# EAGLE design SBX_connector_outline (EAGLE 7.3.0)
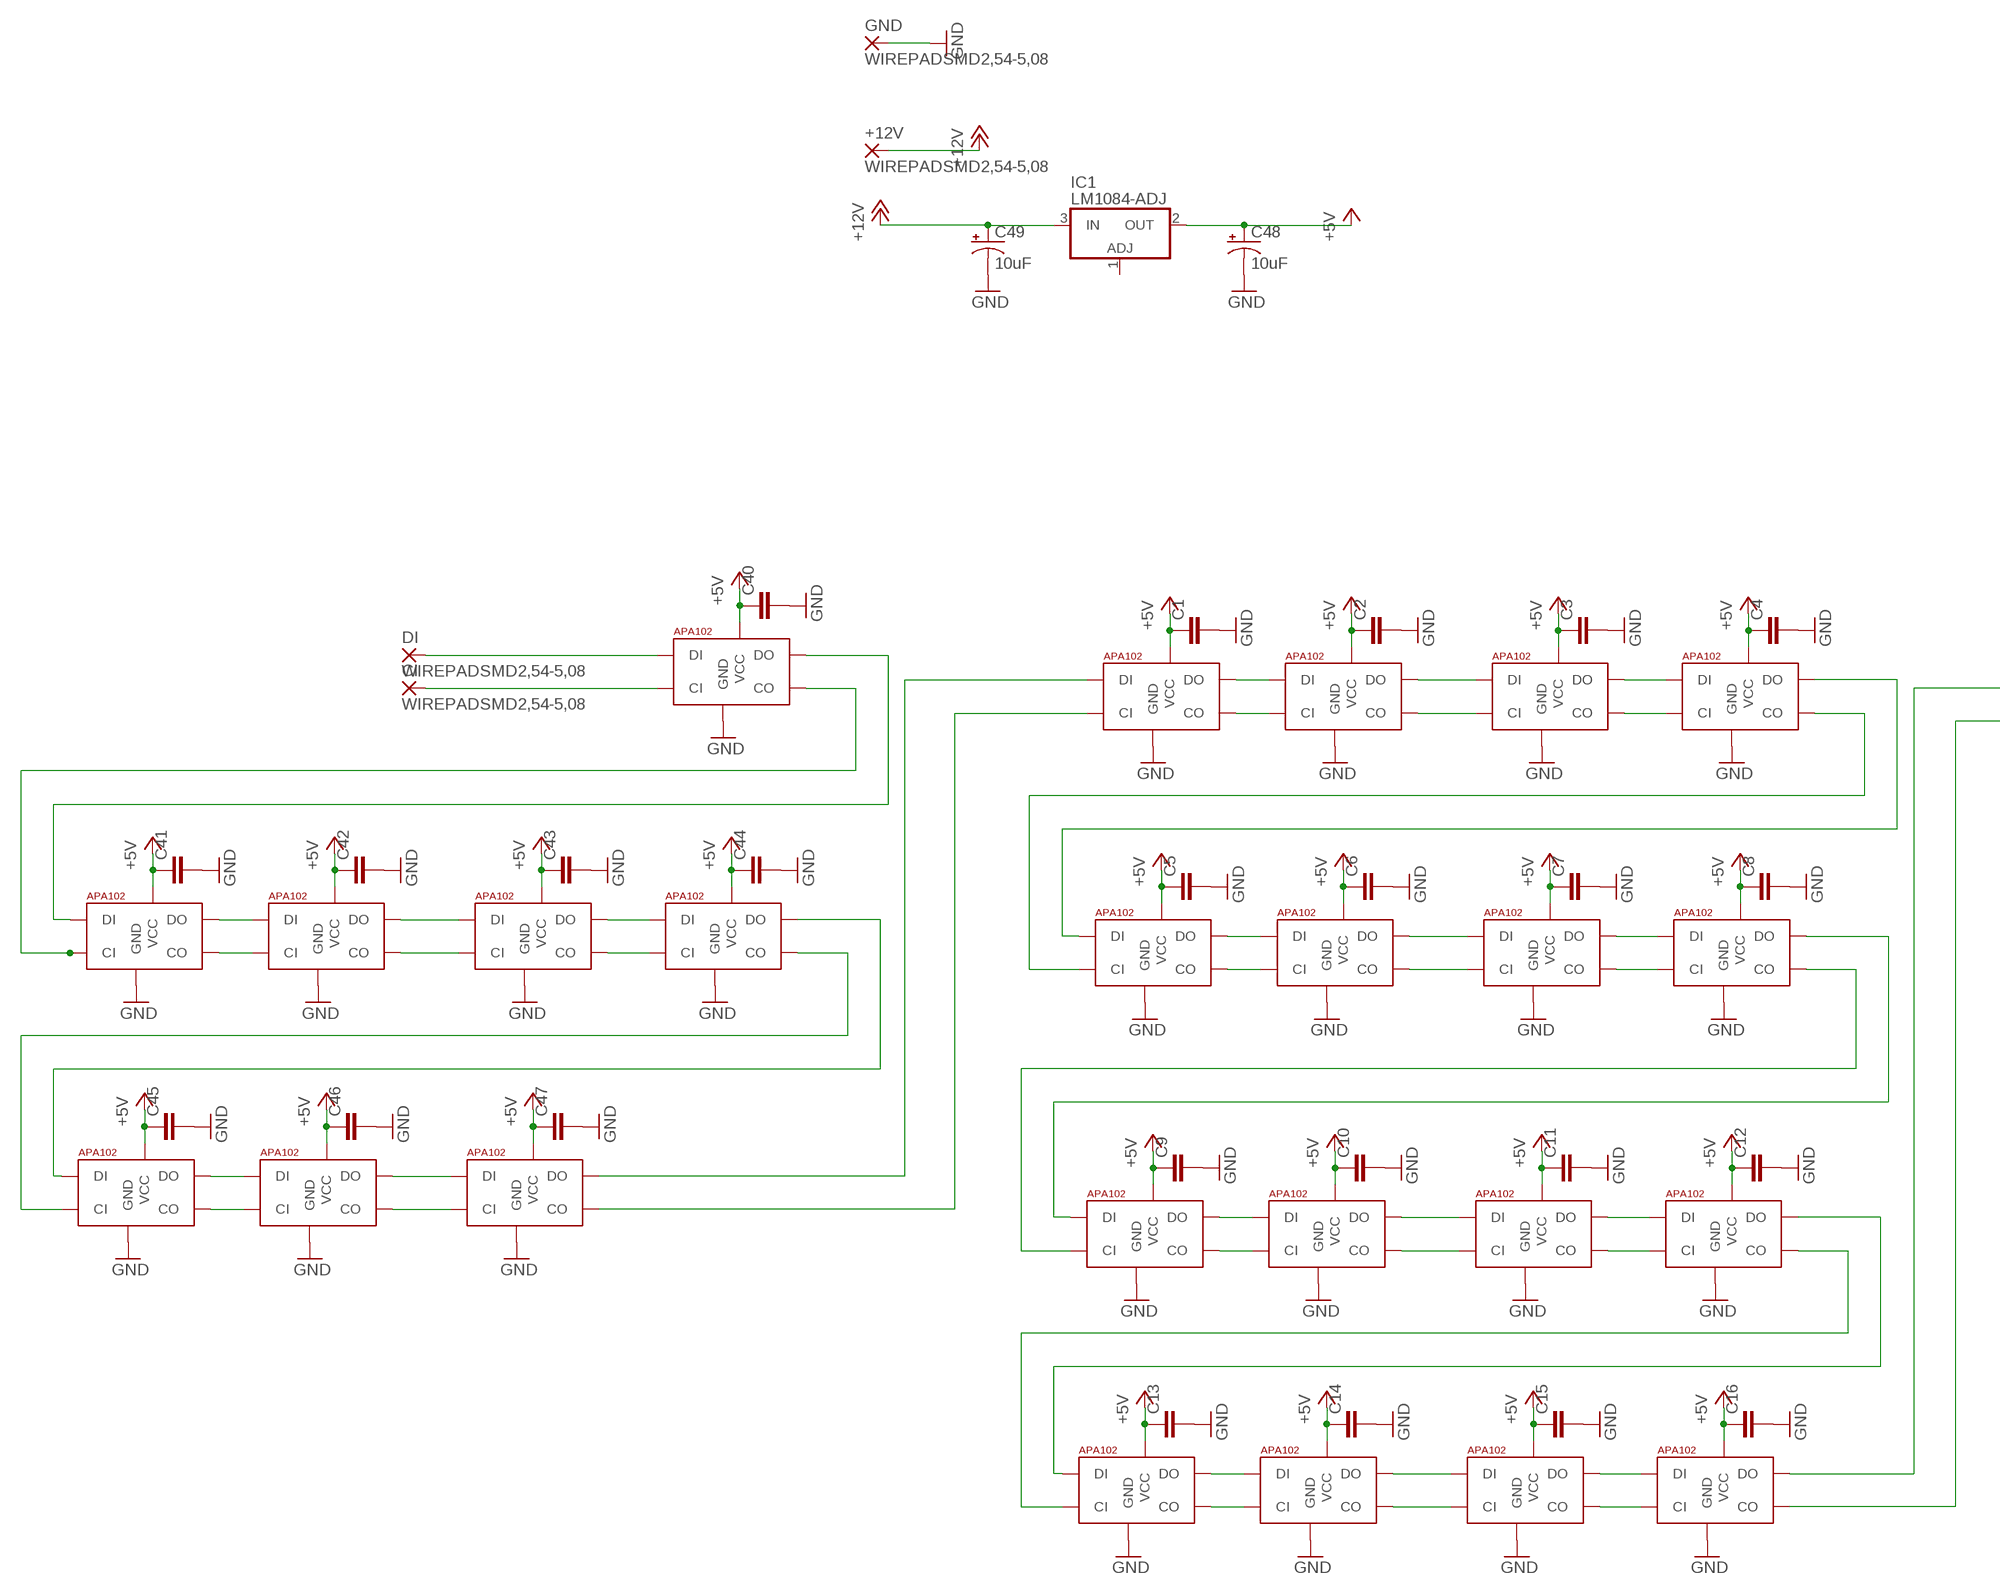
[diagram p0: schematic, sheet 1, part 1 of 2]
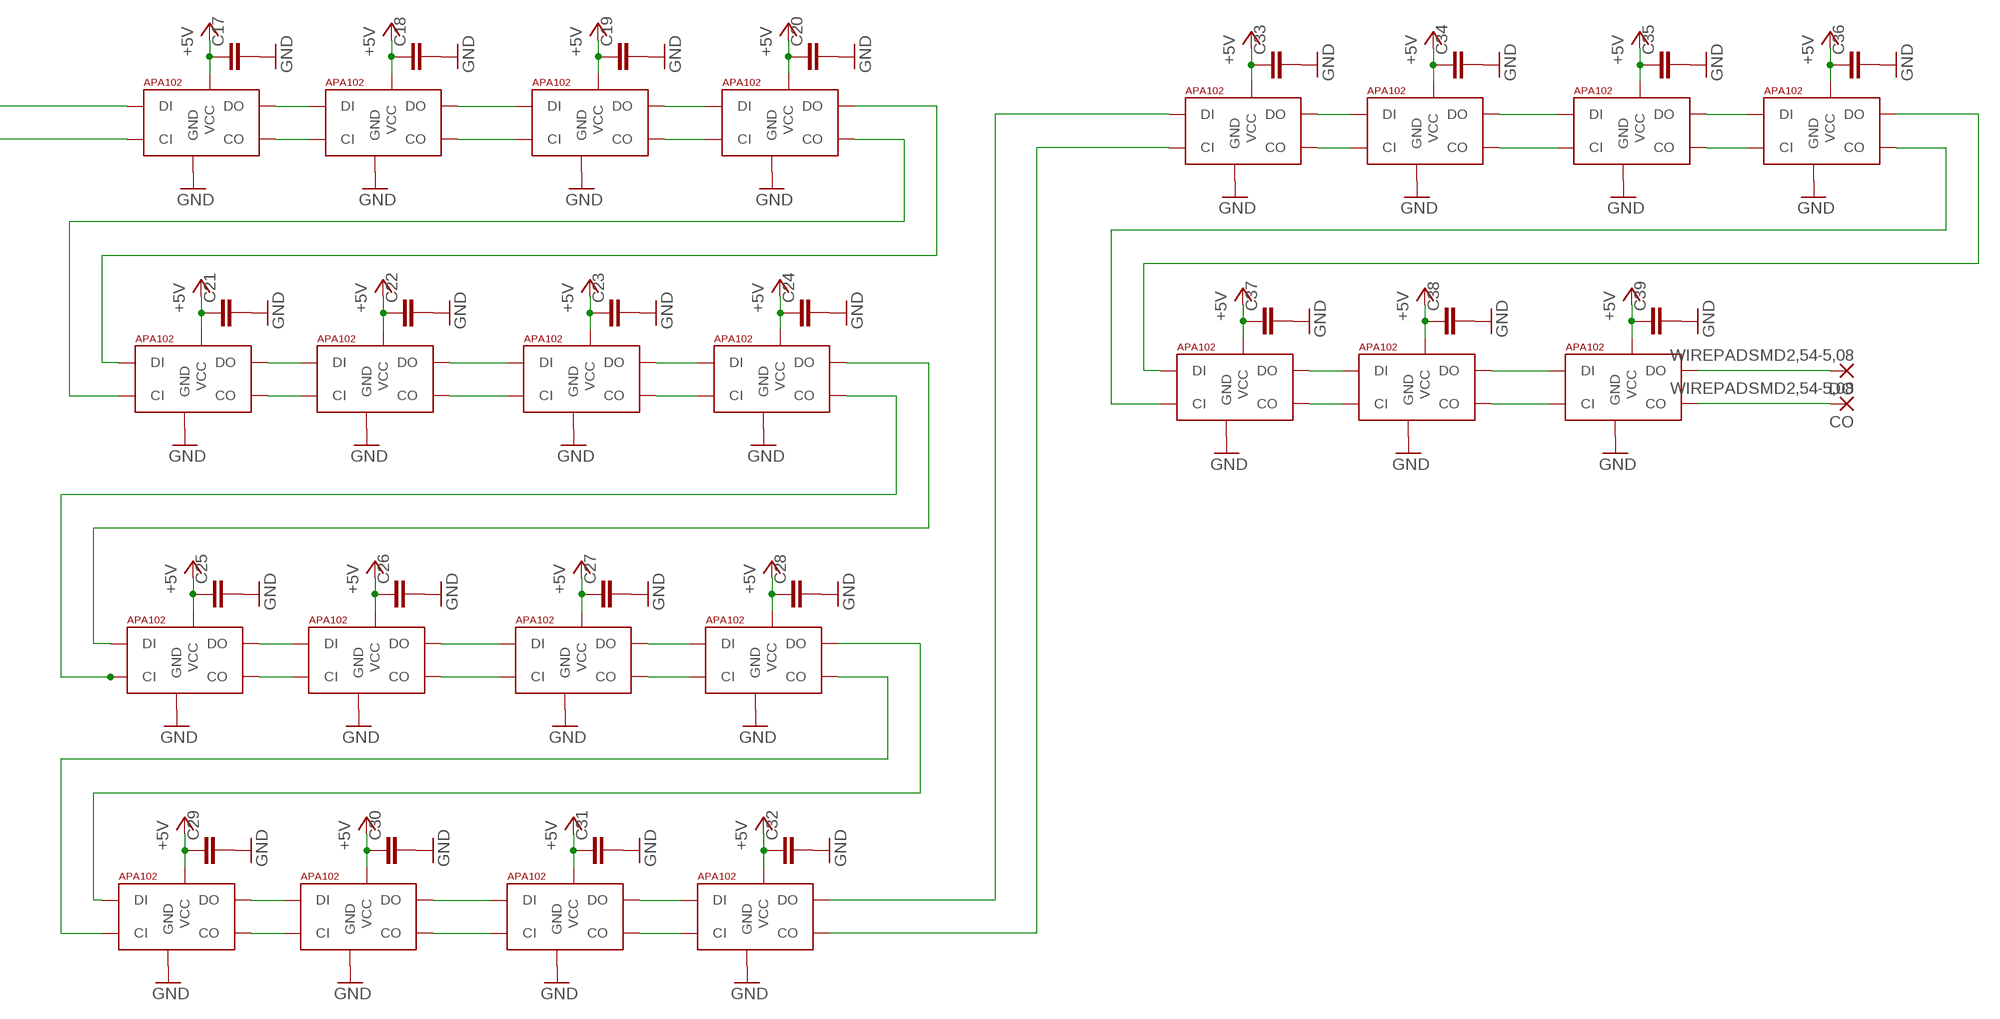
[diagram p1: schematic, sheet 1, part 2 of 2]

## Parts
+12V  WIREPADSMD2,54-5,08  [SMD2,54-5,08]
C1  CAP0603-CAP  [0603-CAP]
C2  CAP0603-CAP  [0603-CAP]
C3  CAP0603-CAP  [0603-CAP]
C4  CAP0603-CAP  [0603-CAP]
C5  CAP0603-CAP  [0603-CAP]
C6  CAP0603-CAP  [0603-CAP]
C7  CAP0603-CAP  [0603-CAP]
C8  CAP0603-CAP  [0603-CAP]
C9  CAP0603-CAP  [0603-CAP]
C10  CAP0603-CAP  [0603-CAP]
C11  CAP0603-CAP  [0603-CAP]
C12  CAP0603-CAP  [0603-CAP]
C13  CAP0603-CAP  [0603-CAP]
C14  CAP0603-CAP  [0603-CAP]
C15  CAP0603-CAP  [0603-CAP]
C16  CAP0603-CAP  [0603-CAP]
C17  CAP0603-CAP  [0603-CAP]
C18  CAP0603-CAP  [0603-CAP]
C19  CAP0603-CAP  [0603-CAP]
C20  CAP0603-CAP  [0603-CAP]
C21  CAP0603-CAP  [0603-CAP]
C22  CAP0603-CAP  [0603-CAP]
C23  CAP0603-CAP  [0603-CAP]
C24  CAP0603-CAP  [0603-CAP]
C25  CAP0603-CAP  [0603-CAP]
C26  CAP0603-CAP  [0603-CAP]
C27  CAP0603-CAP  [0603-CAP]
C28  CAP0603-CAP  [0603-CAP]
C29  CAP0603-CAP  [0603-CAP]
C30  CAP0603-CAP  [0603-CAP]
C31  CAP0603-CAP  [0603-CAP]
C32  CAP0603-CAP  [0603-CAP]
C33  CAP0603-CAP  [0603-CAP]
C34  CAP0603-CAP  [0603-CAP]
C35  CAP0603-CAP  [0603-CAP]
C36  CAP0603-CAP  [0603-CAP]
C37  CAP0603-CAP  [0603-CAP]
C38  CAP0603-CAP  [0603-CAP]
C39  CAP0603-CAP  [0603-CAP]
C40  CAP0603-CAP  [0603-CAP]
C41  CAP0603-CAP  [0603-CAP]
C42  CAP0603-CAP  [0603-CAP]
C43  CAP0603-CAP  [0603-CAP]
C44  CAP0603-CAP  [0603-CAP]
C45  CAP0603-CAP  [0603-CAP]
C46  CAP0603-CAP  [0603-CAP]
C47  CAP0603-CAP  [0603-CAP]
C48  10uF  10UF-TANT  [EIA3216]
C49  10uF  10UF-TANT  [EIA3216]
CI  WIREPADSMD2,54-5,08  [SMD2,54-5,08]
CO  WIREPADSMD2,54-5,08  [SMD2,54-5,08]
DI  WIREPADSMD2,54-5,08  [SMD2,54-5,08]
DO  WIREPADSMD2,54-5,08  [SMD2,54-5,08]
GND  WIREPADSMD2,54-5,08  [SMD2,54-5,08]
IC1  LM1084-ADJ  [TO263-3]
U$1  APA1025050  [APA102_5050]
U$2  APA1025050  [APA102_5050]
U$3  APA1025050  [APA102_5050]
U$4  APA1025050  [APA102_5050]
U$5  APA1025050  [APA102_5050]
U$6  APA1025050  [APA102_5050]
U$7  APA1025050  [APA102_5050]
U$8  APA1025050  [APA102_5050]
U$9  APA1025050  [APA102_5050]
U$10  APA1025050  [APA102_5050]
U$11  APA1025050  [APA102_5050]
U$12  APA1025050  [APA102_5050]
U$13  APA1025050  [APA102_5050]
U$14  APA1025050  [APA102_5050]
U$15  APA1025050  [APA102_5050]
U$16  APA1025050  [APA102_5050]
U$17  APA1025050  [APA102_5050]
U$18  APA1025050  [APA102_5050]
U$19  APA1025050  [APA102_5050]
U$20  APA1025050  [APA102_5050]
U$21  APA1025050  [APA102_5050]
U$22  APA1025050  [APA102_5050]
U$23  APA1025050  [APA102_5050]
U$24  APA1025050  [APA102_5050]
U$25  APA1025050  [APA102_5050]
U$26  APA1025050  [APA102_5050]
U$27  APA1025050  [APA102_5050]
U$28  APA1025050  [APA102_5050]
U$29  APA1025050  [APA102_5050]
U$30  APA1025050  [APA102_5050]
U$31  APA1025050  [APA102_5050]
U$32  APA1025050  [APA102_5050]
U$33  APA1025050  [APA102_5050]
U$34  APA1025050  [APA102_5050]
U$35  APA1025050  [APA102_5050]
U$36  APA1025050  [APA102_5050]
U$37  APA1025050  [APA102_5050]
U$38  APA1025050  [APA102_5050]
U$39  APA1025050  [APA102_5050]
U$40  APA1025050  [APA102_5050]
U$41  APA1025050  [APA102_5050]
U$42  APA1025050  [APA102_5050]
U$43  APA1025050  [APA102_5050]
U$44  APA1025050  [APA102_5050]
U$45  APA1025050  [APA102_5050]
U$46  APA1025050  [APA102_5050]
U$47  APA1025050  [APA102_5050]

## Nets
+5V: C1.1 C2.1 C3.1 C4.1 C5.1 C6.1 C7.1 C8.1 C9.1 C10.1 C11.1 C12.1 C13.1 C14.1 C15.1 C16.1 C17.1 C18.1 C19.1 C20.1 C21.1 C22.1 C23.1 C24.1 C25.1 C26.1 C27.1 C28.1 C29.1 C30.1 C31.1 C32.1 C33.1 C34.1 C35.1 C36.1 C37.1 C38.1 C39.1 C40.1 C41.1 C42.1 C43.1 C44.1 C45.1 C46.1 C47.1 C48.A(+) IC1.2(OUT) U$1.1(VCC) U$2.1(VCC) U$3.1(VCC) U$4.1(VCC) U$5.1(VCC) U$6.1(VCC) U$7.1(VCC) U$8.1(VCC) U$9.1(VCC) U$10.1(VCC) U$11.1(VCC) U$12.1(VCC) U$13.1(VCC) U$14.1(VCC) U$15.1(VCC) U$16.1(VCC) U$17.1(VCC) U$18.1(VCC) U$19.1(VCC) U$20.1(VCC) U$21.1(VCC) U$22.1(VCC) U$23.1(VCC) U$24.1(VCC) U$25.1(VCC) U$26.1(VCC) U$27.1(VCC) U$28.1(VCC) U$29.1(VCC) U$30.1(VCC) U$31.1(VCC) U$32.1(VCC) U$33.1(VCC) U$34.1(VCC) U$35.1(VCC) U$36.1(VCC) U$37.1(VCC) U$38.1(VCC) U$39.1(VCC) U$40.1(VCC) U$41.1(VCC) U$42.1(VCC) U$43.1(VCC) U$44.1(VCC) U$45.1(VCC) U$46.1(VCC) U$47.1(VCC)
+12V: +12V.1(P) C49.A(+) IC1.3(IN)
GND: C1.2 C2.2 C3.2 C4.2 C5.2 C6.2 C7.2 C8.2 C9.2 C10.2 C11.2 C12.2 C13.2 C14.2 C15.2 C16.2 C17.2 C18.2 C19.2 C20.2 C21.2 C22.2 C23.2 C24.2 C25.2 C26.2 C27.2 C28.2 C29.2 C30.2 C31.2 C32.2 C33.2 C34.2 C35.2 C36.2 C37.2 C38.2 C39.2 C40.2 C41.2 C42.2 C43.2 C44.2 C45.2 C46.2 C47.2 C48.C(-) C49.C(-) GND.1(P) U$1.6(GND) U$2.6(GND) U$3.6(GND) U$4.6(GND) U$5.6(GND) U$6.6(GND) U$7.6(GND) U$8.6(GND) U$9.6(GND) U$10.6(GND) U$11.6(GND) U$12.6(GND) U$13.6(GND) U$14.6(GND) U$15.6(GND) U$16.6(GND) U$17.6(GND) U$18.6(GND) U$19.6(GND) U$20.6(GND) U$21.6(GND) U$22.6(GND) U$23.6(GND) U$24.6(GND) U$25.6(GND) U$26.6(GND) U$27.6(GND) U$28.6(GND) U$29.6(GND) U$30.6(GND) U$31.6(GND) U$32.6(GND) U$33.6(GND) U$34.6(GND) U$35.6(GND) U$36.6(GND) U$37.6(GND) U$38.6(GND) U$39.6(GND) U$40.6(GND) U$41.6(GND) U$42.6(GND) U$43.6(GND) U$44.6(GND) U$45.6(GND) U$46.6(GND) U$47.6(GND)
N$1: U$1.3(DO) U$2.4(DI)
N$2: U$1.2(CO) U$2.5(CI)
N$3: U$2.3(DO) U$3.4(DI)
N$4: U$2.2(CO) U$3.5(CI)
N$5: U$3.3(DO) U$4.4(DI)
N$6: U$3.2(CO) U$4.5(CI)
N$7: U$4.3(DO) U$5.4(DI)
N$8: U$4.2(CO) U$5.5(CI)
N$9: U$5.3(DO) U$6.4(DI)
N$10: U$5.2(CO) U$6.5(CI)
N$11: U$6.3(DO) U$7.4(DI)
N$12: U$6.2(CO) U$7.5(CI)
N$13: U$7.3(DO) U$8.4(DI)
N$14: U$7.2(CO) U$8.5(CI)
N$15: U$8.3(DO) U$9.4(DI)
N$16: U$8.2(CO) U$9.5(CI)
N$17: U$9.3(DO) U$10.4(DI)
N$18: U$9.2(CO) U$10.5(CI)
N$19: U$10.3(DO) U$11.4(DI)
N$20: U$10.2(CO) U$11.5(CI)
N$21: U$11.3(DO) U$12.4(DI)
N$22: U$11.2(CO) U$12.5(CI)
N$23: U$12.3(DO) U$13.4(DI)
N$24: U$12.2(CO) U$13.5(CI)
N$25: U$13.3(DO) U$14.4(DI)
N$26: U$13.2(CO) U$14.5(CI)
N$27: U$14.3(DO) U$15.4(DI)
N$28: U$14.2(CO) U$15.5(CI)
N$29: U$15.3(DO) U$16.4(DI)
N$30: U$15.2(CO) U$16.5(CI)
N$31: U$16.3(DO) U$17.4(DI)
N$32: U$32.3(DO) U$33.4(DI)
N$33: U$17.3(DO) U$18.4(DI)
N$34: U$17.2(CO) U$18.5(CI)
N$35: U$18.3(DO) U$19.4(DI)
N$36: U$18.2(CO) U$19.5(CI)
N$37: U$19.3(DO) U$20.4(DI)
N$38: U$19.2(CO) U$20.5(CI)
N$39: U$20.3(DO) U$21.4(DI)
N$40: U$20.2(CO) U$21.5(CI)
N$41: U$21.3(DO) U$22.4(DI)
N$42: U$21.2(CO) U$22.5(CI)
N$43: U$22.3(DO) U$23.4(DI)
N$44: U$22.2(CO) U$23.5(CI)
N$45: U$23.3(DO) U$24.4(DI)
N$46: U$23.2(CO) U$24.5(CI)
N$47: U$24.3(DO) U$25.4(DI)
N$48: U$24.2(CO) U$25.5(CI)
N$49: U$25.3(DO) U$26.4(DI)
N$50: U$25.2(CO) U$26.5(CI)
N$51: U$26.3(DO) U$27.4(DI)
N$52: U$26.2(CO) U$27.5(CI)
N$53: U$27.3(DO) U$28.4(DI)
N$54: U$27.2(CO) U$28.5(CI)
N$55: U$28.3(DO) U$29.4(DI)
N$56: U$28.2(CO) U$29.5(CI)
N$57: U$29.3(DO) U$30.4(DI)
N$58: U$29.2(CO) U$30.5(CI)
N$59: U$30.3(DO) U$31.4(DI)
N$60: U$30.2(CO) U$31.5(CI)
N$61: U$31.3(DO) U$32.4(DI)
N$62: U$31.2(CO) U$32.5(CI)
N$63: U$1.4(DI) U$47.3(DO)
N$64: U$1.5(CI) U$47.2(CO)
N$65: U$33.3(DO) U$34.4(DI)
N$66: U$16.2(CO) U$17.5(CI)
N$67: U$33.2(CO) U$34.5(CI)
N$68: U$34.3(DO) U$35.4(DI)
N$69: U$34.2(CO) U$35.5(CI)
N$70: U$35.3(DO) U$36.4(DI)
N$71: U$35.2(CO) U$36.5(CI)
N$72: U$36.3(DO) U$37.4(DI)
N$73: U$36.2(CO) U$37.5(CI)
N$74: U$37.3(DO) U$38.4(DI)
N$75: U$37.2(CO) U$38.5(CI)
N$76: U$38.3(DO) U$39.4(DI)
N$77: U$38.2(CO) U$39.5(CI)
N$78: DO.1(P) U$39.3(DO)
N$79: CO.1(P) U$39.2(CO)
N$80: U$40.3(DO) U$41.4(DI)
N$81: U$40.2(CO) U$41.5(CI)
N$82: U$41.3(DO) U$42.4(DI)
N$83: U$41.2(CO) U$42.5(CI)
N$84: U$42.3(DO) U$43.4(DI)
N$85: U$42.2(CO) U$43.5(CI)
N$86: U$43.3(DO) U$44.4(DI)
N$87: U$43.2(CO) U$44.5(CI)
N$88: U$44.3(DO) U$45.4(DI)
N$89: U$44.2(CO) U$45.5(CI)
N$90: U$45.3(DO) U$46.4(DI)
N$91: U$45.2(CO) U$46.5(CI)
N$92: U$46.3(DO) U$47.4(DI)
N$93: U$46.2(CO) U$47.5(CI)
N$94: CI.1(P) U$40.5(CI)
N$95: DI.1(P) U$40.4(DI)
N$98: U$32.2(CO) U$33.5(CI)
Unconnected: IC1.1(ADJ)

## Library data of the parts
+12V CI CO DI DO GND = wirepad:WIREPAD: Wire PAD connect wire on PCB
C1-C47 = SparkFun-Capacitors:CAP: Capacitor Standard 0603 ceramic capacitor, and 0.1" leaded capacitor.
C48 C49 = SparkFun-Retired:10UF-TANT: 10uF Tantalum SMT CAP-00811- 16V 10% (EIA-3216); PROD_ID: CAP-00811
IC1 = lm1084-adj-to263:LM1084-ADJ: LM1084-ADJ 5A 29V - Voltage Regulator Autor: Cleber Moretti Web site: http://www.binarycodec.blogspot.com v.1.2
U$1-U$47 = jos-ph:APA102: APA102C 5050 RGB LED -- Adafruit DotStar Single LED Pixel Product Page: https://www.adafruit.com/products/2343 Datasheet: https://cdn-shop.adafruit.com/product-files/2343/APA102C.pdf

## Board
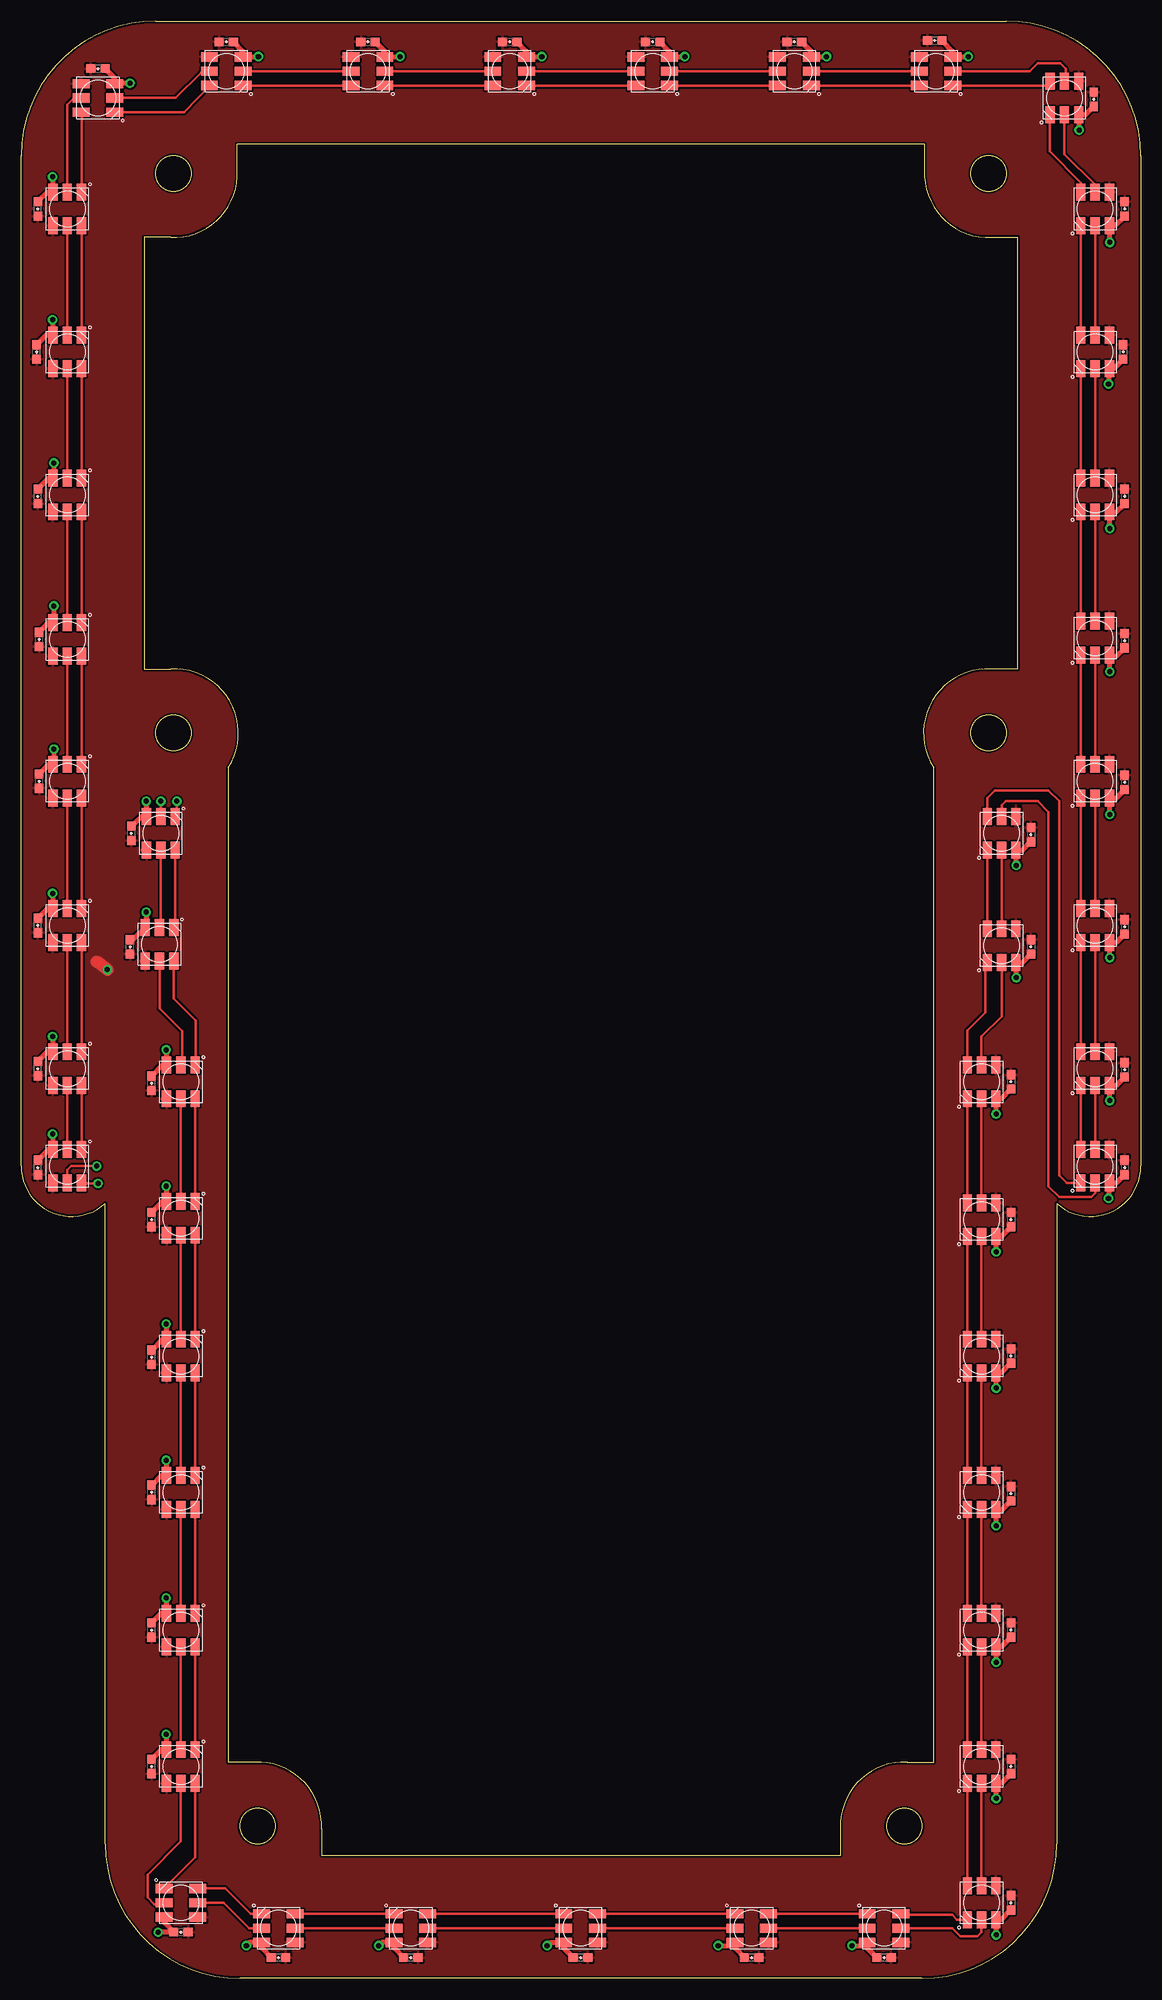
[diagram p2: board, top side]
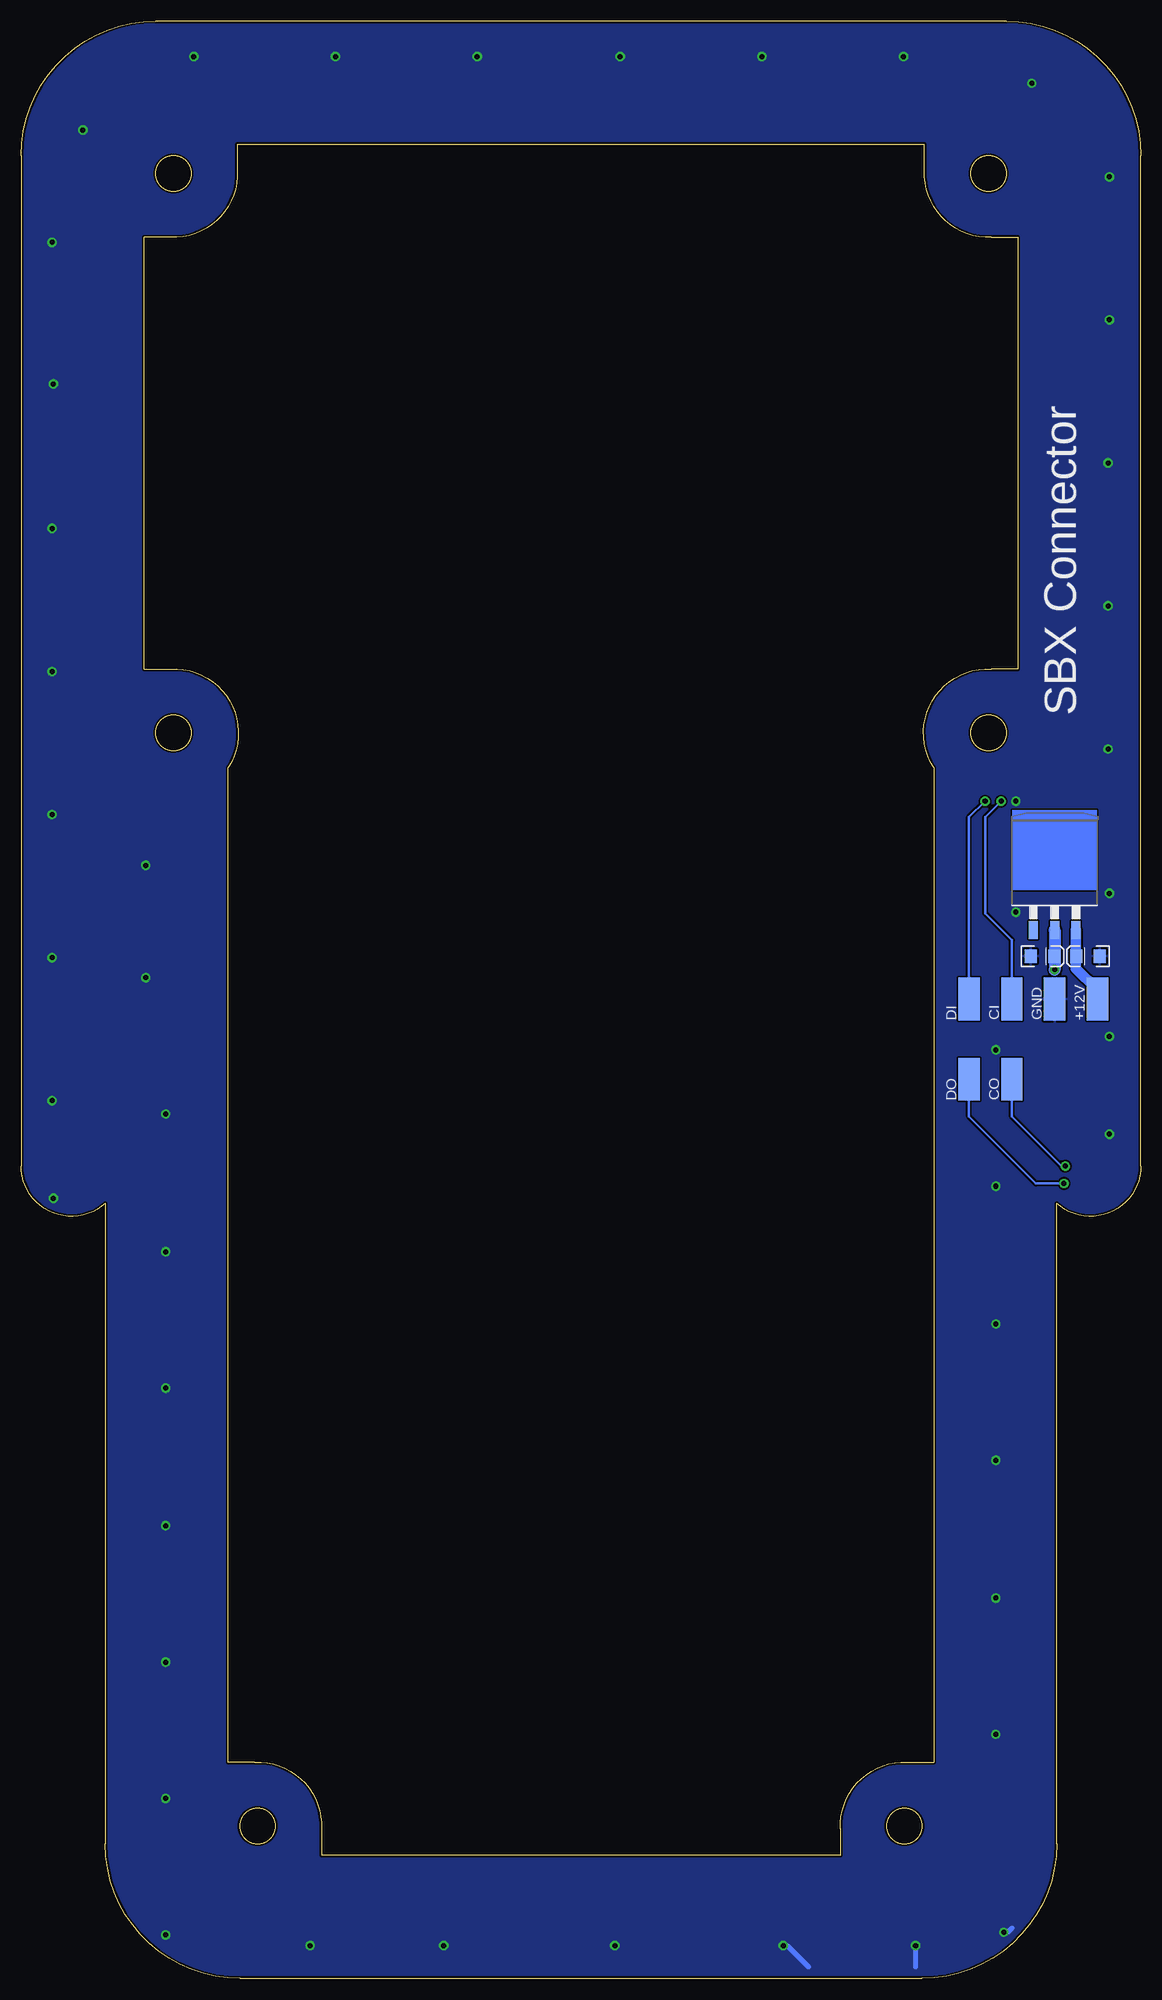
[diagram p3: board, bottom side, seen from below]

Size 133 x 232.43 mm. Coordinates in mm from the lower left corner, seen from the top.
Outline: 27.76,25.69 arc-95 35.69,17.76 35.69,14.62 97.31,14.62 97.31,17.76 arc-95 105.24,25.69 108.38,25.69 108.38,143.77 arc-126 115.24,155.5 118.38,155.5 118.38,206.74 115.24,206.74 arc-95 107.31,214.67 107.31,217.81 25.69,217.81 25.69,214.72
Outline: 25.69,214.67 arc-95 17.76,206.74 14.62,206.74 14.62,155.5 17.76,155.5 arc-126 24.62,143.77 24.62,25.69 28,25.69
Outline: 0,96.49 0,216.43 arc-90 16,232.43 117,232.43 arc-90 133,216.43 133,96.49 arc-132 123,92.02 123,16 arc-90 107,0 26,0 arc-90 10,16 10,92.02 arc-132 0,96.49
Outline: circle at 18.1,147.91 radius 2.1
Outline: circle at 18.1,214.33 radius 2.1
Outline: circle at 114.9,214.33 radius 2.1
Outline: circle at 114.9,147.91 radius 2.1
Outline: circle at 104.91,18.1 radius 2.1
Outline: circle at 28.09,18.1 radius 2.1
Copper layers (1*16): Top 0.035mm / dielectric 1.5mm / Bottom 0.035mm
Design rules "SparkFun": minimum track width 8mil, minimum drill 20mil, track to track 8mil, track to pad 8mil, pad to pad 8mil, via to via 8mil, smd to smd 8mil, copper to edge 10mil, drill to drill 8mil, minimum pad ring 12mil, minimum via ring 10mil, stop-mask expansion 4mil, vias tented up to drill 25mil, thermal gap 10mil

### Footprints (pad centres in the part's own frame; a part is rotated, then mirrored left to right if it is on the bottom)
SMD2,54-5,08 = smd 2.54 x 5.08: 1 0,0
0603-CAP = smd 1.1 x 1: 1 -0.85,0; 2 0.85,0
EIA3216 = smd 1.4 x 1.6: A 1.4,0; C -1.4,0
TO263-3 = smd 1.067 x 2.159: 1 -2.54,-5.791; 2 0,-5.791; 3 2.54,-5.791
APA102_5050 = smd 2 x 1.1: 1 2,-1.7; 2 2,0; 3 2,1.7; 4 -2,1.7; 5 -2,0; 6 -2,-1.7

### Placement (x,y rotation side)
+12V  5.17,116.3 0 bottom
C1  18.98,5.49 180 top
C2  30.57,2.48 180 top
C3  46.29,2.48 180 top
C4  66.45,2.48 180 top
C5  86.77,2.48 180 top
C6  102.48,2.48 180 top
C7  117.56,8.98 270 top
C8  117.56,25.18 270 top
C9  117.56,41.37 270 top
C10  117.56,57.56 270 top
C11  117.56,73.91 270 top
C12  117.56,90.11 270 top
C13  117.56,106.46 270 top
C14  119.95,122.49 270 top
C15  119.95,135.83 270 top
C16  131.06,96.3 270 top
C17  131.06,107.89 270 top
C18  131.06,124.87 270 top
C19  131.06,142.02 270 top
C20  131.06,158.84 270 top
C21  131.06,175.99 270 top
C22  130.9,193.13 270 top
C23  131.06,210.12 270 top
C24  127.41,223.14 270 top
C25  108.52,230.12 0 top
C26  91.85,229.96 0 top
C27  75.02,229.96 0 top
C28  58.03,229.96 0 top
C29  41.21,229.96 0 top
C30  24.38,229.96 0 top
C31  9.14,226.79 0 top
C32  1.99,210.12 90 top
C33  1.84,193.13 90 top
C34  1.99,175.99 90 top
C35  2.15,159 90 top
C36  2.15,142.18 90 top
C37  1.99,125.03 90 top
C38  1.99,108.04 90 top
C39  1.99,96.3 90 top
C40  13.11,135.98 90 top
C41  12.95,122.49 90 top
C42  15.49,106.3 90 top
C43  15.49,90.11 90 top
C44  15.49,73.75 90 top
C45  15.49,57.72 90 top
C46  15.49,41.37 90 top
C47  15.49,25.18 90 top
C48  11.68,121.38 0 bottom
C49  6.28,121.38 180 bottom
CI  15.33,116.3 0 bottom
CO  15.33,106.77 0 bottom
DI  20.41,116.3 0 bottom
DO  20.41,106.77 0 bottom
GND  10.25,116.3 0 bottom
IC1  10.25,130.27 0 bottom
U$1  18.98,8.98 0 top
U$2  30.57,5.97 0 top
U$3  46.29,5.97 0 top
U$4  66.45,5.97 0 top
U$5  86.77,5.97 0 top
U$6  102.48,5.97 0 top
U$7  114.07,8.98 90 top
U$8  114.07,25.18 90 top
U$9  114.07,41.37 90 top
U$10  114.07,57.72 90 top
U$11  114.07,73.91 90 top
U$12  114.07,90.11 90 top
U$13  114.07,106.46 90 top
U$14  116.45,122.65 90 top
U$15  116.45,135.98 90 top
U$16  127.57,96.46 90 top
U$17  127.57,108.04 90 top
U$18  127.57,125.03 90 top
U$19  127.57,142.18 90 top
U$20  127.57,159.16 90 top
U$21  127.57,176.15 90 top
U$22  127.57,193.13 90 top
U$23  127.57,210.12 90 top
U$24  123.92,223.3 90 top
U$25  108.67,226.47 180 top
U$26  91.85,226.47 180 top
U$27  75.02,226.47 180 top
U$28  58.03,226.47 180 top
U$29  41.21,226.47 180 top
U$30  24.38,226.47 180 top
U$31  9.14,223.3 180 top
U$32  5.49,210.12 270 top
U$33  5.49,193.13 270 top
U$34  5.49,176.15 270 top
U$35  5.49,159 270 top
U$36  5.49,142.18 270 top
U$37  5.49,125.03 270 top
U$38  5.49,108.04 270 top
U$39  5.49,96.46 270 top
U$40  16.6,135.98 270 top
U$41  16.44,122.81 270 top
U$42  18.98,106.46 270 top
U$43  18.98,90.26 270 top
U$44  18.98,73.91 270 top
U$45  18.98,57.72 270 top
U$46  18.98,41.37 270 top
U$47  18.98,25.18 270 top

### Tracks (layer width: path | path; a pad name or v marks a point on that pad's centre or on a via)
+5V  (via drill 0.6)
  Top 1.422: v10.25,119.79 8.98,120.74
  Bottom 1.422: IC1.2 10.25,121.51 | 10.25,121.51 C48.A | 10.25,121.51 10.22,121.83 v10.25,119.79
  pour Top: -6.26,237.58 -3.72,-6.26 143.6,-6.26 141.06,237.58
+12V
  Bottom 1.27: IC1.3 7.71,121.41 C49.A 7.71,121.35 7.71,119.95 5.17,117.41 +12V.1
GND  (via drill 0.6)
  Top 0.61: U$1.6 16.98,6.64 C1.2 v16.28,5.49 | C2.2 28.57,3.62 U$2.6 27.12,4.27 v26.76,3.9 | C3.2 44.29,3.62 U$3.6 42.84,4.27 v42.48,3.9 | U$4.6 64.45,4.16 | C4.2 64.45,3.62 64.45,4.16 | U$5.6 84.77,3.62 | 84.77,3.62 C5.2 | C6.2 100.48,3.62 U$6.6 100.42,4.2 100.42,3.9 v98.67,3.9 | C7.2 116.42,6.98 U$7.6 115.77,5.22 v115.82,5.17 | C8.2 116.42,23.18 U$8.6 115.77,21.41 v115.82,21.37 | 64.45,4.16 64.38,4.22 62.8,4.22 v62.48,3.9 | C9.2 116.42,39.37 U$9.6 115.77,37.6 v115.82,37.56 | v82.8,3.9 84.49,3.9 84.77,3.62 | v115.82,53.75 115.77,53.8 U$10.6 116.42,55.56 C10.2 | v125.66,219.49 125.62,219.53 U$24.6 126.42,221.3 C24.2 | v129.31,206.15 129.27,206.2 U$23.6 129.91,208.12 C23.2 | v129.15,189.32 129.11,189.37 U$22.6 129.75,191.13 C22.2 | v129.31,172.18 129.27,172.22 U$21.6 129.91,173.99 C21.2 | v129.31,155.19 129.27,155.24 U$20.6 130.07,157 C20.2 | v129.31,138.21 129.27,138.25 U$19.6 129.91,140.02 C19.2 | v129.31,121.22 129.27,121.27 U$18.6 130.07,123.03 C18.2 | v118.2,118.84 118.15,118.88 U$14.6 118.95,120.65 C14.2 | v129.31,104.23 129.27,104.28 U$17.6 130.07,106.04 C17.2 | v129.15,92.64 129.11,92.69 U$16.6 130.07,94.45 C16.2 | v115.82,102.65 115.77,102.69 U$13.6 116.42,104.46 C13.2 | v115.82,86.29 115.77,86.34 U$12.6 116.42,88.1 C12.2 | v115.82,70.1 115.77,70.15 U$11.6 116.42,71.91 C11.2 | v17.23,77.72 17.28,77.68 U$44.6 16.8,75.91 C44.2 | v17.23,94.07 17.28,94.03 U$43.6 16.8,92.26 C43.2 | v17.23,61.53 17.28,61.48 U$45.6 16.64,59.72 C45.2 | v17.23,45.18 17.28,45.13 U$46.6 16.64,43.37 C46.2 | v17.23,28.99 17.28,28.94 U$47.6 16.64,27.18 C47.2 | v28.19,228.22 28.14,228.17 U$30.6 26.38,228.81 C30.2
  Top 0.61: v45.02,228.22 44.97,228.17 U$29.6 43.21,228.81 C29.2 | v61.84,228.22 61.8,228.17 U$28.6 60.03,228.81 C28.2 | v78.83,228.22 78.78,228.17 U$27.6 77.02,228.81 C27.2 | v95.66,228.22 95.93,228.17 U$26.6 93.85,228.81 C26.2 | v112.48,228.22 112.44,228.17 U$25.6 110.67,228.81 C25.2 | v118.2,132.17 118.15,132.22 U$15.6 118.95,133.98 C15.2 | v17.23,110.27 17.23,108.5 | 17.23,108.5 U$42.6 | v14.85,126.62 14.85,124.85 U$41.6 13.27,123.34 C41.2 | v3.74,128.84 3.74,127.08 | 3.74,127.08 U$37.6 | v3.74,111.85 3.74,110.09 | 3.74,110.09 U$38.6 | v3.74,100.26 3.74,98.5 | 3.74,98.5 U$39.6 | C31.2 11.14,225.64 U$31.6 11.18,225.04 v12.95,225.04 | C32.2 3.15,212.12 U$32.6 3.74,212.17 v3.74,213.93 | v3.74,196.94 3.74,195.18 | 3.74,195.18 U$33.6 | v3.9,179.96 3.9,178.19 U$34.6 3.3,178.15 C34.2 | v3.9,162.97 3.9,161.21 | 3.9,161.21 U$35.6 | v14.85,139.79 14.85,138.52 | 14.85,138.52 14.85,138.03 U$40.6 | v3.9,145.98 3.9,144.22 | 3.9,144.22 U$36.6 | 3.74,195.18 3.03,195.18 C33.2 | 3.9,161.21 3.51,161.21 C35.2 | 3.9,144.22 3.35,144.22 C36.2 | 3.74,127.08 3.19,127.08 C37.2 | 3.74,110.09 3.19,110.09 C38.2 | C40.2 13.16,136.83 14.85,138.52 | 17.23,108.5 16.84,108.5 C42.2 | 3.74,98.5 3.35,98.5 C39.2
  Bottom 0.61: v16.28,5.49 15.81,5.49 15.33,5.97 | v26.76,3.9 26.76,1.36 | v42.48,3.9 42,3.9 39.46,1.36 | v62.48,3.9 62.32,3.9
  pour Bottom: -6.26,245.2 -6.26,-6.26 141.06,-6.26 141.06,245.2
N$1
  Top 0.305: U$2.4 27.28,7.67 24.22,10.73 21.03,10.73 U$1.3
N$2
  Top 0.305: U$1.2 24.06,8.98 27.08,5.97 U$2.5
N$3
  Top 0.305: U$2.3 U$3.4
N$4
  Top 0.305: U$2.2 U$3.5
N$5
  Top 0.305: U$3.3 U$4.4
N$6
  Top 0.305: U$3.2 U$4.5
N$7
  Top 0.305: U$4.3 U$5.4
N$8
  Top 0.305: U$4.2 U$5.5
N$9
  Top 0.305: U$5.3 U$6.4
N$10
  Top 0.305: U$5.2 U$6.5
N$11
  Top 0.305: U$7.4 111.15,6.98 110.58,7.55 104.6,7.55 U$6.3
N$12
  Top 0.305: U$6.2 110.58,5.97 111.53,5.01 113.6,5.01 114.07,5.49 U$7.5
N$13
  Top 0.305: U$8.4 U$7.3
N$14
  Top 0.305: U$8.5 U$7.2
N$15
  Top 0.305: U$8.3 U$9.4
N$16
  Top 0.305: U$8.2 U$9.5
N$17
  Top 0.305: U$9.3 U$10.4
N$18
  Top 0.305: U$9.2 U$10.5
N$19
  Top 0.305: U$10.3 U$11.4
N$20
  Top 0.305: U$10.2 U$11.5
N$21
  Top 0.305: U$11.3 U$12.4
N$22
  Top 0.305: U$11.2 U$12.5
N$23
  Top 0.305: U$12.3 U$13.4
N$24
  Top 0.305: U$12.2 U$13.5
N$25
  Top 0.305: U$13.3 112.37,112.53 114.55,114.71 114.55,120.44 U$14.4
N$26
  Top 0.305: U$13.2 114.07,111.85 116.45,114.23 U$14.5
N$27
  Top 0.305: U$14.3 U$15.4
N$28
  Top 0.305: U$14.2 U$15.5
N$29
  Top 0.305: U$15.3 114.75,140.16 115.66,141.06 122.01,141.06 123.28,139.79 123.28,95.34 124.17,94.45 U$16.4
N$30
  Top 0.305: U$15.2 116.45,139.32 116.93,139.79 120.74,139.79 122.01,138.52 122.01,94.07 123.28,92.8 127.09,92.8 127.57,93.28 U$16.5
N$31
  Top 0.305: U$17.4 U$16.3
N$32
  Top 0.305: U$32.3 U$33.4
N$33
  Top 0.305: U$18.4 U$17.3
N$34
  Top 0.305: U$18.5 U$17.2
N$35
  Top 0.305: U$19.4 U$18.3
N$36
  Top 0.305: U$19.5 U$18.2
N$37
  Top 0.305: U$19.3 U$20.4
N$38
  Top 0.305: U$19.2 U$20.5
N$39
  Top 0.305: U$21.4 U$20.3
N$40
  Top 0.305: U$21.5 U$20.2
N$41
  Top 0.305: U$22.4 U$21.3
N$42
  Top 0.305: U$22.5 U$21.2
N$43
  Top 0.305: U$23.4 U$22.3
N$44
  Top 0.305: U$23.5 U$22.2
N$45
  Top 0.305: U$23.3 125.87,213.25 122.17,216.95 122.17,221.25 U$24.4
N$46
  Top 0.305: U$23.2 127.57,212.98 123.92,216.63 U$24.5
N$47
  Top 0.305: U$25.4 121.69,224.77 U$24.3
N$48
  Top 0.305: U$24.2 124.07,225.45 124.07,226.79 123.44,227.42 120.74,227.42 119.79,226.47 U$25.5
N$49
  Top 0.305: U$26.4 U$25.3
N$50
  Top 0.305: U$25.2 U$26.5
N$51
  Top 0.305: U$27.4 U$26.3
N$52
  Top 0.305: U$27.5 U$26.2
N$53
  Top 0.305: U$28.4 U$27.3
N$54
  Top 0.305: U$28.5 U$27.2
N$55
  Top 0.305: U$29.4 U$28.3
N$56
  Top 0.305: U$29.5 U$28.2
N$57
  Top 0.305: U$29.3 U$30.4
N$58
  Top 0.305: U$30.5 U$29.2
N$59
  Top 0.305: U$31.4 19.36,221.6 U$30.3
N$60
  Top 0.305: U$31.5 18.35,223.3 21.36,226.31 U$30.2
N$61
  Top 0.305: U$32.4 7.19,221.55 U$31.3
N$62
  Top 0.305: U$32.5 5.49,222.5 6.44,223.45 6.98,223.45 U$31.2
N$63
  Top 0.305: U$47.3 20.68,14.38 U$1.4
N$64
  Top 0.305: U$47.2 18.98,16.29 15.01,12.32 15.01,9.62 15.81,8.82 16.82,8.82 U$1.5
N$65
  Top 0.305: U$33.3 U$34.4
N$66
  Top 0.305: U$17.5 U$16.2
N$67
  Top 0.305: U$33.2 U$34.5
N$68
  Top 0.305: U$34.3 U$35.4
N$69
  Top 0.305: U$34.2 U$35.5
N$70
  Top 0.305: U$35.3 U$36.4
N$71
  Top 0.305: U$35.2 U$36.5
N$72
  Top 0.305: 7.35,127.19 U$37.4 U$36.3
N$73
  Top 0.305: 5.65,127.19 U$37.5 U$36.2
N$74
  Top 0.305: U$37.3 U$38.4
N$75
  Top 0.305: U$37.2 U$38.5
N$76
  Top 0.305: U$38.3 U$39.4
N$77
  Top 0.305: U$38.2 U$39.5
N$78  (via drill 0.6)
  Top 0.305: v9.14,94.39 7.25,94.39 U$39.3
  Bottom 0.305: v9.14,94.39 12.47,94.39 20.41,102.33 DO.1
N$79  (via drill 0.6)
  Top 0.305: v8.98,96.45 5.96,96.45 5.49,95.98 U$39.2
  Bottom 0.305: v8.98,96.45 9.46,96.45 15.33,102.33 CO.1
N$80
  Top 0.305: U$40.3 18.3,124.97 U$41.4
N$81
  Top 0.305: U$40.2 16.6,124.97 U$41.5
N$82
  Top 0.305: U$41.3 18.14,116.34 20.73,113.76 20.73,108.5 U$42.4
N$83
  Top 0.305: U$41.2 16.44,115.19 19.14,112.49 19.14,108.61 U$42.5
N$84
  Top 0.305: U$42.3 U$43.4
N$85
  Top 0.305: U$42.2 U$43.5
N$86
  Top 0.305: 20.84,76.07 U$44.4 U$43.3
N$87
  Top 0.305: 19.14,76.07 U$44.5 U$43.2
N$88
  Top 0.305: U$44.3 U$45.4
N$89
  Top 0.305: U$44.2 U$45.5
N$90
  Top 0.305: U$45.3 U$46.4
N$91
  Top 0.305: U$45.2 U$46.5
N$92
  Top 0.305: U$46.3 U$47.4
N$93
  Top 0.305: U$46.2 U$47.5
N$94  (via drill 0.6)
  Top 0.305: v16.6,139.79 U$40.5
  Bottom 0.305: CI.1 15.33,123.28 18.51,126.46 18.51,137.89 v16.6,139.79
N$95  (via drill 0.6)
  Top 0.305: v18.51,139.79 18.51,138.19 U$40.4
  Bottom 0.305: DI.1 20.41,137.89 v18.51,139.79
N$98
  Top 0.305: U$32.2 U$33.5

### Text on the board
bNames: SBX Connector